# EAGLE schematic Z801 (EAGLE 7.6.0)

## Sheet 1 of 2
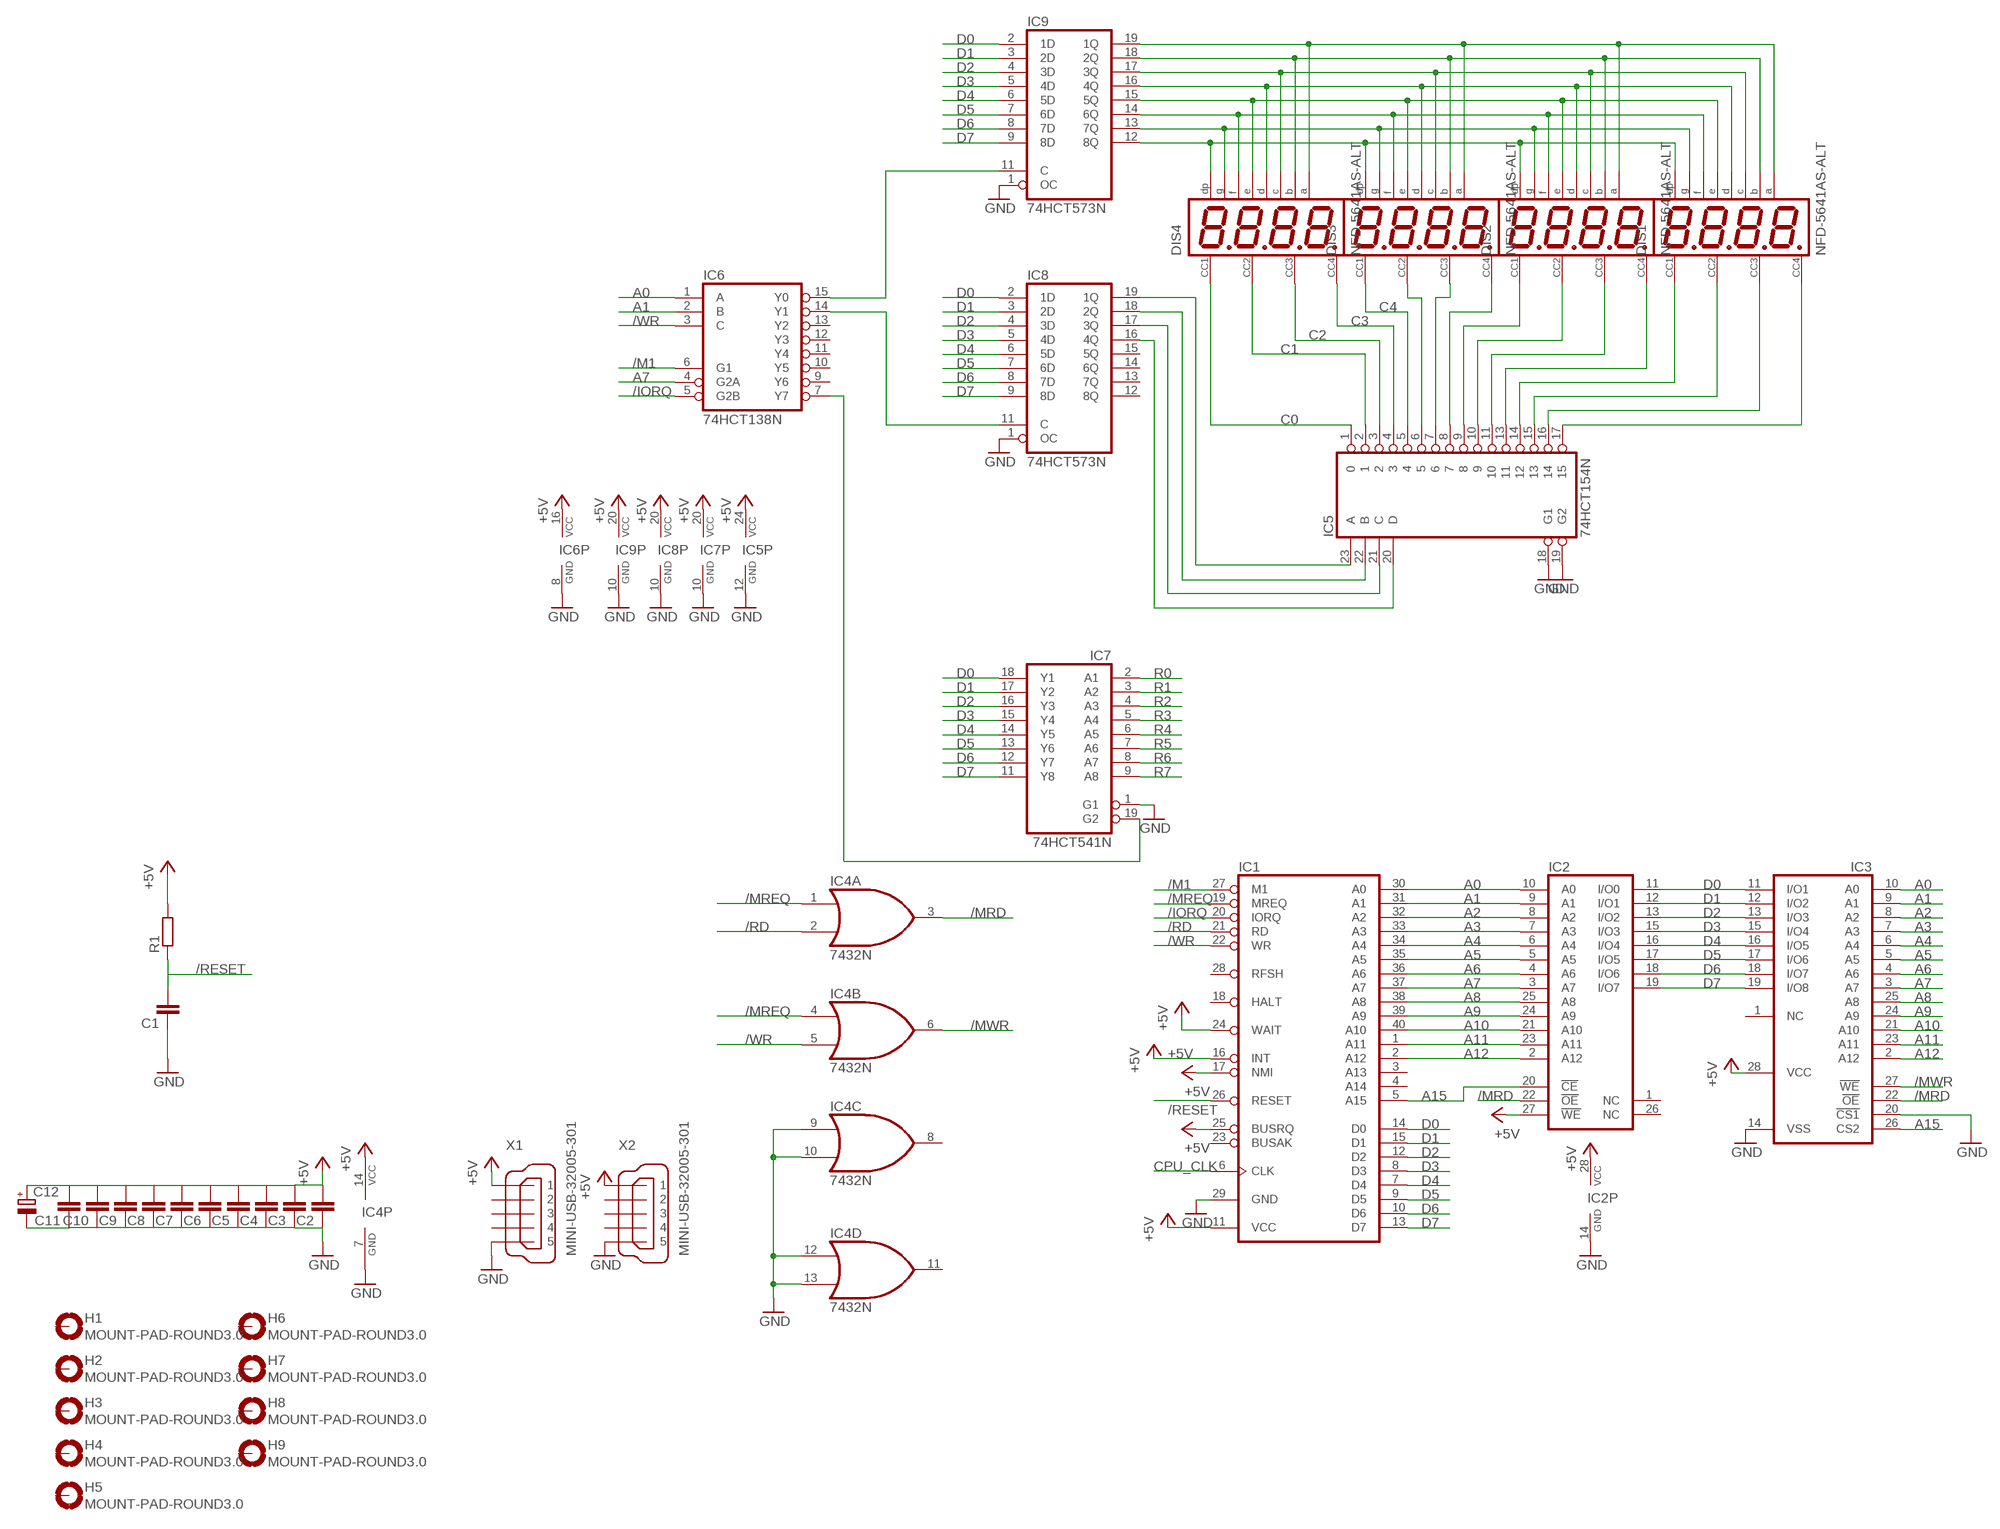
[diagram p0: schematic, sheet 1, part 1 of 2]
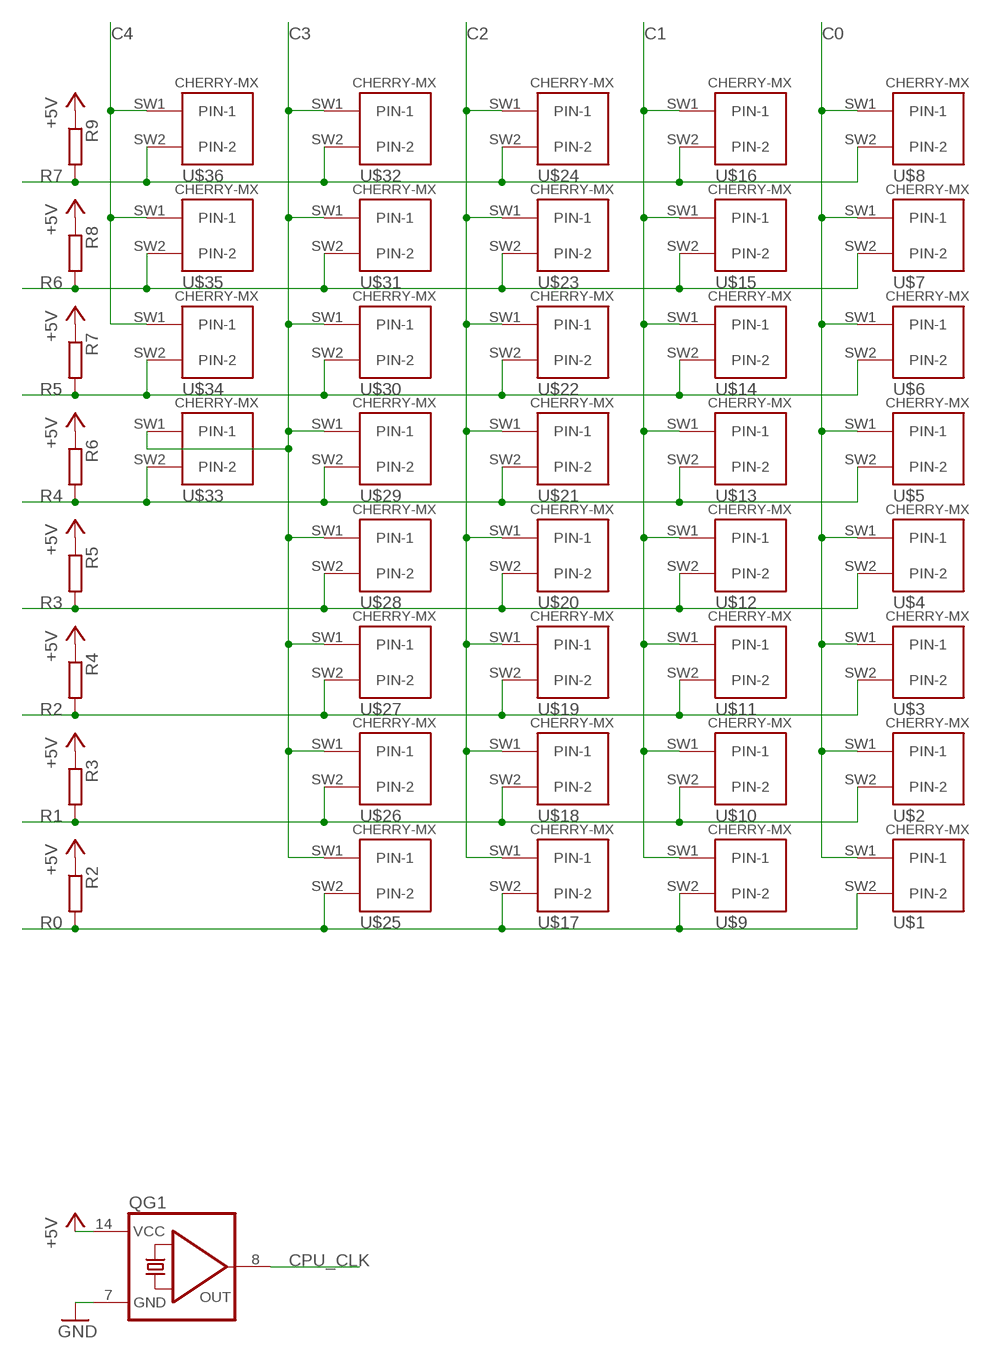
[diagram p1: schematic, sheet 1, part 2 of 2]

### Parts
C1  C-EUC1206  [C1206]
C2  C-EUC1206  [C1206]
C3  C-EUC1206  [C1206]
C4  C-EUC1206  [C1206]
C5  C-EUC1206  [C1206]
C6  C-EUC1206  [C1206]
C7  C-EUC1206  [C1206]
C8  C-EUC1206  [C1206]
C9  C-EUC1206  [C1206]
C10  C-EUC1206  [C1206]
C11  C-EUC1206  [C1206]
C12  CPOL-EUSMCD  [SMC_D]
DIS1  NFD-5641AS-ALT  [NFD-5641]
DIS2  NFD-5641AS-ALT  [NFD-5641]
DIS3  NFD-5641AS-ALT  [NFD-5641]
DIS4  NFD-5641AS-ALT  [NFD-5641]
H1  MOUNT-PAD-ROUND3.0  [3,0-PAD]
H2  MOUNT-PAD-ROUND3.0  [3,0-PAD]
H3  MOUNT-PAD-ROUND3.0  [3,0-PAD]
H4  MOUNT-PAD-ROUND3.0  [3,0-PAD]
H5  MOUNT-PAD-ROUND3.0  [3,0-PAD]
H6  MOUNT-PAD-ROUND3.0  [3,0-PAD]
H7  MOUNT-PAD-ROUND3.0  [3,0-PAD]
H8  MOUNT-PAD-ROUND3.0  [3,0-PAD]
H9  MOUNT-PAD-ROUND3.0  [3,0-PAD]
IC1  Z80CPU  [DIL40]
IC2  78C64P  [DIL28-6]
IC3  6264A  [DIL28-6]
IC4  7432N  [DIL14]
IC5  74HCT154N  [DIL24-6]
IC6  74HCT138N  [DIL16]
IC7  74HCT541N  [DIL20]
IC8  74HCT573N  [DIL20]
IC9  74HCT573N  [DIL20]
QG1  QG5860  [DIL14S]
R1  R-EU_R1206  [R1206]
R2  R-EU_R1206  [R1206]
R3  R-EU_R1206  [R1206]
R4  R-EU_R1206  [R1206]
R5  R-EU_R1206  [R1206]
R6  R-EU_R1206  [R1206]
R7  R-EU_R1206  [R1206]
R8  R-EU_R1206  [R1206]
R9  R-EU_R1206  [R1206]
U$1  CHERRY-MX  [CHERRY-MX]
U$2  CHERRY-MX  [CHERRY-MX]
U$3  CHERRY-MX  [CHERRY-MX]
U$4  CHERRY-MX  [CHERRY-MX]
U$5  CHERRY-MX  [CHERRY-MX]
U$6  CHERRY-MX  [CHERRY-MX]
U$7  CHERRY-MX  [CHERRY-MX]
U$8  CHERRY-MX  [CHERRY-MX]
U$9  CHERRY-MX  [CHERRY-MX]
U$10  CHERRY-MX  [CHERRY-MX]
U$11  CHERRY-MX  [CHERRY-MX]
U$12  CHERRY-MX  [CHERRY-MX]
U$13  CHERRY-MX  [CHERRY-MX]
U$14  CHERRY-MX  [CHERRY-MX]
U$15  CHERRY-MX  [CHERRY-MX]
U$16  CHERRY-MX  [CHERRY-MX]
U$17  CHERRY-MX  [CHERRY-MX]
U$18  CHERRY-MX  [CHERRY-MX]
U$19  CHERRY-MX  [CHERRY-MX]
U$20  CHERRY-MX  [CHERRY-MX]
U$21  CHERRY-MX  [CHERRY-MX]
U$22  CHERRY-MX  [CHERRY-MX]
U$23  CHERRY-MX  [CHERRY-MX]
U$24  CHERRY-MX  [CHERRY-MX]
U$25  CHERRY-MX  [CHERRY-MX]
U$26  CHERRY-MX  [CHERRY-MX]
U$27  CHERRY-MX  [CHERRY-MX]
U$28  CHERRY-MX  [CHERRY-MX]
U$29  CHERRY-MX  [CHERRY-MX]
U$30  CHERRY-MX  [CHERRY-MX]
U$31  CHERRY-MX  [CHERRY-MX]
U$32  CHERRY-MX  [CHERRY-MX]
U$33  CHERRY-MX  [CHERRY-MX]
U$34  CHERRY-MX  [CHERRY-MX]
U$35  CHERRY-MX  [CHERRY-MX]
U$36  CHERRY-MX  [CHERRY-MX]
X1  MINI-USB-32005-301  [32005-301]
X2  MINI-USB-32005-301  [32005-301]

### Nets
+5V: C2.2 C3.2 C4.2 C5.2 C6.2 C7.2 C8.2 C9.2 C10.2 C11.2 C12.+ IC1.11(VCC) IC1.16(INT) IC1.17(NMI) IC1.24(WAIT) IC1.25(BUSRQ) IC2.27(!WE) IC2.28(VCC) IC3.28(VCC) IC4.14(P:VCC) IC5.24(VCC) IC6.16(VCC) IC7.20(VCC) IC8.20(VCC) IC9.20(VCC) QG1.14(VCC) R1.2 R2.1 R3.1 R4.1 R5.1 R6.1 R7.1 R8.1 R9.1 X1.1 X2.1
/IORQ: IC1.20(IORQ) IC6.5(G2B)
/M1: IC1.27(M1) IC6.6(G1)
/MRD: IC2.22(!OE) IC3.22(!OE) IC4.3(A:O)
/MREQ: IC1.19(MREQ) IC4.1(A:I0) IC4.4(B:I0)
/MWR: IC3.27(!WE) IC4.6(B:O)
/RD: IC1.21(RD) IC4.2(A:I1)
/RESET: C1.2 IC1.26(RESET) R1.1
/WR: IC1.22(WR) IC4.5(B:I1) IC6.3(C)
A0: IC1.30(A0) IC2.10(A0) IC3.10(A0) IC6.1(A)
A1: IC1.31(A1) IC2.9(A1) IC3.9(A1) IC6.2(B)
A2: IC1.32(A2) IC2.8(A2) IC3.8(A2)
A3: IC1.33(A3) IC2.7(A3) IC3.7(A3)
A4: IC1.34(A4) IC2.6(A4) IC3.6(A4)
A5: IC1.35(A5) IC2.5(A5) IC3.5(A5)
A6: IC1.36(A6) IC2.4(A6) IC3.4(A6)
A7: IC1.37(A7) IC2.3(A7) IC3.3(A7) IC6.4(G2A)
A8: IC1.38(A8) IC2.25(A8) IC3.25(A8)
A9: IC1.39(A9) IC2.24(A9) IC3.24(A9)
A10: IC1.40(A10) IC2.21(A10) IC3.21(A10)
A11: IC1.1(A11) IC2.23(A11) IC3.23(A11)
A12: IC1.2(A12) IC2.2(A12) IC3.2(A12)
A15: IC1.5(A15) IC2.20(!CE) IC3.26(CS2)
C0: DIS4.P$12 IC5.1 U$1.SW1(PIN-1) U$2.SW1(PIN-1) U$3.SW1(PIN-1) U$4.SW1(PIN-1) U$5.SW1(PIN-1) U$6.SW1(PIN-1) U$7.SW1(PIN-1) U$8.SW1(PIN-1)
C1: DIS4.P$9 IC5.2 U$9.SW1(PIN-1) U$10.SW1(PIN-1) U$11.SW1(PIN-1) U$12.SW1(PIN-1) U$13.SW1(PIN-1) U$14.SW1(PIN-1) U$15.SW1(PIN-1) U$16.SW1(PIN-1)
C2: DIS4.P$8 IC5.3 U$17.SW1(PIN-1) U$18.SW1(PIN-1) U$19.SW1(PIN-1) U$20.SW1(PIN-1) U$21.SW1(PIN-1) U$22.SW1(PIN-1) U$23.SW1(PIN-1) U$24.SW1(PIN-1)
C3: DIS4.P$6 IC5.4 U$25.SW1(PIN-1) U$26.SW1(PIN-1) U$27.SW1(PIN-1) U$28.SW1(PIN-1) U$29.SW1(PIN-1) U$30.SW1(PIN-1) U$31.SW1(PIN-1) U$32.SW1(PIN-1) U$33.SW1(PIN-1)
C4: DIS3.P$12 IC5.5 U$34.SW1(PIN-1) U$35.SW1(PIN-1) U$36.SW1(PIN-1)
CPU_CLK: IC1.6(CLK) QG1.8(OUT)
D0: IC1.14(D0) IC2.11(I/O0) IC3.11(I/O1) IC7.18(Y1) IC8.2(1D) IC9.2(1D)
D1: IC1.15(D1) IC2.12(I/O1) IC3.12(I/O2) IC7.17(Y2) IC8.3(2D) IC9.3(2D)
D2: IC1.12(D2) IC2.13(I/O2) IC3.13(I/O3) IC7.16(Y3) IC8.4(3D) IC9.4(3D)
D3: IC1.8(D3) IC2.15(I/O3) IC3.15(I/O4) IC7.15(Y4) IC8.5(4D) IC9.5(4D)
D4: IC1.7(D4) IC2.16(I/O4) IC3.16(I/O5) IC7.14(Y5) IC8.6(5D) IC9.6(5D)
D5: IC1.9(D5) IC2.17(I/O5) IC3.17(I/O6) IC7.13(Y6) IC8.7(6D) IC9.7(6D)
D6: IC1.10(D6) IC2.18(I/O6) IC3.18(I/O7) IC7.12(Y7) IC8.8(7D) IC9.8(7D)
D7: IC1.13(D7) IC2.19(I/O7) IC3.19(I/O8) IC7.11(Y8) IC8.9(8D) IC9.9(8D)
GND: C1.1 C2.1 C3.1 C4.1 C5.1 C6.1 C7.1 C8.1 C9.1 C10.1 C11.1 C12.- IC1.29(GND) IC2.14(GND) IC3.14(VSS) IC3.20(!CS1) IC4.7(P:GND) IC4.9(C:I0) IC4.10(C:I1) IC4.12(D:I0) IC4.13(D:I1) IC5.12(GND) IC5.18(G1) IC5.19(G2) IC6.8(GND) IC7.1(G1) IC7.10(GND) IC8.1(OC) IC8.10(GND) IC9.1(OC) IC9.10(GND) QG1.7(GND) X1.5 X2.5
N$1: IC6.15(Y0) IC9.11(C)
N$2: IC5.20(D) IC8.16(4Q)
N$3: IC6.14(Y1) IC8.11(C)
N$4: IC5.21(C) IC8.17(3Q)
N$5: IC5.22(B) IC8.18(2Q)
N$6: IC5.23(A) IC8.19(1Q)
N$8: IC6.7(Y7) IC7.19(G2)
N$13: DIS3.P$9 IC5.6
N$14: DIS3.P$8 IC5.7
N$15: DIS3.P$6 IC5.8
N$16: DIS2.P$12 IC5.9
N$17: DIS2.P$9 IC5.10
N$18: DIS2.P$8 IC5.11
N$19: DIS2.P$6 IC5.13
N$20: DIS1.P$12 IC5.14
N$21: DIS1.P$9 IC5.15
N$22: DIS1.P$8 IC5.16
N$23: DIS1.P$6 IC5.17
N$31: DIS1.P$3 DIS2.P$3 DIS3.P$3 DIS4.P$3 IC9.12(8Q)
N$32: DIS1.P$5 DIS2.P$5 DIS3.P$5 DIS4.P$5 IC9.13(7Q)
N$33: DIS1.P$10 DIS2.P$10 DIS3.P$10 DIS4.P$10 IC9.14(6Q)
N$34: DIS1.P$1 DIS2.P$1 DIS3.P$1 DIS4.P$1 IC9.15(5Q)
N$35: DIS1.P$11 DIS2.P$11 DIS3.P$11 DIS4.P$11 IC9.19(1Q)
N$36: DIS1.P$7 DIS2.P$7 DIS3.P$7 DIS4.P$7 IC9.18(2Q)
N$37: DIS1.P$4 DIS2.P$4 DIS3.P$4 DIS4.P$4 IC9.17(3Q)
N$38: DIS1.P$2 DIS2.P$2 DIS3.P$2 DIS4.P$2 IC9.16(4Q)
R0: IC7.2(A1) R2.2 U$1.SW2(PIN-2) U$9.SW2(PIN-2) U$17.SW2(PIN-2) U$25.SW2(PIN-2)
R1: IC7.3(A2) R3.2 U$2.SW2(PIN-2) U$10.SW2(PIN-2) U$18.SW2(PIN-2) U$26.SW2(PIN-2)
R2: IC7.4(A3) R4.2 U$3.SW2(PIN-2) U$11.SW2(PIN-2) U$19.SW2(PIN-2) U$27.SW2(PIN-2)
R3: IC7.5(A4) R5.2 U$4.SW2(PIN-2) U$12.SW2(PIN-2) U$20.SW2(PIN-2) U$28.SW2(PIN-2)
R4: IC7.6(A5) R6.2 U$5.SW2(PIN-2) U$13.SW2(PIN-2) U$21.SW2(PIN-2) U$29.SW2(PIN-2) U$33.SW2(PIN-2)
R5: IC7.7(A6) R7.2 U$6.SW2(PIN-2) U$14.SW2(PIN-2) U$22.SW2(PIN-2) U$30.SW2(PIN-2) U$34.SW2(PIN-2)
R6: IC7.8(A7) R8.2 U$7.SW2(PIN-2) U$15.SW2(PIN-2) U$23.SW2(PIN-2) U$31.SW2(PIN-2) U$35.SW2(PIN-2)
R7: IC7.9(A8) R9.2 U$8.SW2(PIN-2) U$16.SW2(PIN-2) U$24.SW2(PIN-2) U$32.SW2(PIN-2) U$36.SW2(PIN-2)
Unconnected: H1.B3,0(MOUNT) H2.B3,0(MOUNT) H3.B3,0(MOUNT) H4.B3,0(MOUNT) H5.B3,0(MOUNT) H6.B3,0(MOUNT) H7.B3,0(MOUNT) H8.B3,0(MOUNT) H9.B3,0(MOUNT) IC1.3(A13) IC1.4(A14) IC1.18(HALT) IC1.23(BUSAK) IC1.28(RFSH) IC2.1(NC) IC2.26(NC) IC3.1(NC) IC4.8(C:O) IC4.11(D:O) IC6.9(Y6) IC6.10(Y5) IC6.11(Y4) IC6.12(Y3) IC6.13(Y2) IC8.12(8Q) IC8.13(7Q) IC8.14(6Q) IC8.15(5Q) X1.2 X1.3 X1.4 X2.2 X2.3 X2.4

## Sheet 2 of 2

## Library data of the parts
C1-C11 = rcl:C-EU: CAPACITOR, European symbol
C12 = rcl:CPOL-EU: POLARIZED CAPACITOR, European symbol
DIS1-DIS4 = display-nfd:NFD-5641AS-ALT: Four Digit 0.56" CC Seven-Segment LED Display Futurlec part number: 7FR5641AS Created by RobG
H1-H9 = holes:MOUNT-PAD-ROUND: MOUNTING PAD, round
IC1 = zilog:Z80CPU: Z80 FAMILY DEVICE
IC2 = memory-idt:78C64P: MEMORY; OC_FARNELL: unknown; OC_NEWARK: unknown
IC3 = memory-hitachi:6264A: MEMORY; OC_FARNELL: 283605; OC_NEWARK: unknown
IC4 = 74xx-us:74*32: Quad 2-input OR gate
IC5 = 74xx-eu:74*154: 4-line to 16-line data SELECTOR/MULTIPLEXER
IC6 = 74xx-eu:74*138: 3-line to 8-line DECODER/DEMULTIPLEXER
IC7 = 74xx-eu:74*541: Octal BUFFER and LINE DRIVER, 3-state
IC8 IC9 = 74xx-eu:74*573: 8-bit D latch BUS DRIVER
QG1 = crystal:QG5860: CRYSTAL RESONATOR; OC_FARNELL: unknown; OC_NEWARK: unknown
R1-R9 = rcl:R-EU_: RESISTOR, European symbol
U$1-U$36 = cherry:CHERRY-MX: Cherry MX series keyswitch
X1 X2 = con-cypressindustries:MINI-USB-: MINI USB-B Conector Source: www.cypressindustries.com; OC_FARNELL: unknown; OC_NEWARK: unknown